# Altium project smart-water-quality-breakout.PrjPcb (part 3 of 5)

## Sheet charger.SchDoc
size A
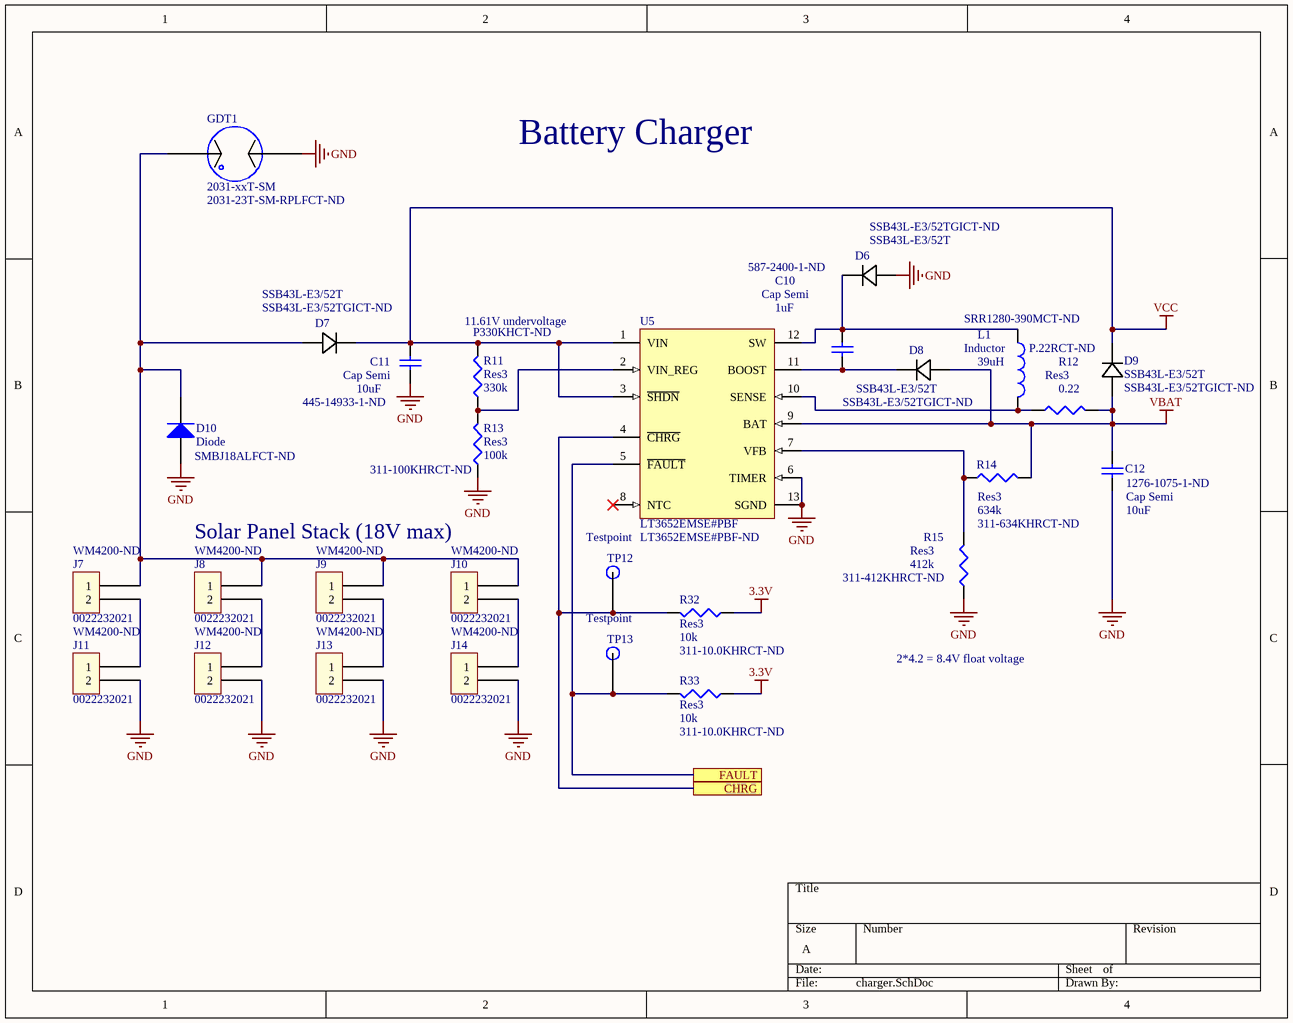
[diagram p2: charger.SchDoc]

### Parts
C10  Cap Semi  value 1uF  Supplier Part Number 1: 587-2400-1-ND  [1608[0603]]
C11  Cap Semi  value 10uF  Supplier Part Number 1: 445-14933-1-ND  [C1210]
C12  Cap Semi  value 10uF  Supplier Part Number 1: 1276-1075-1-ND  [C1206]
D6  SSB43L-E3/52T  Supplier Part Number 1: SSB43L-E3/52TGICT-ND  [DIODE_DO214AA_00]
D7  SSB43L-E3/52T  Supplier Part Number 1: SSB43L-E3/52TGICT-ND  [DIODE_DO214AA_00]
D8  SSB43L-E3/52T  Supplier Part Number 1: SSB43L-E3/52TGICT-ND  [DIODE_DO214AA_00]
D9  SSB43L-E3/52T  Supplier Part Number 1: SSB43L-E3/52TGICT-ND  [DIODE_DO214AA_00]
D10  Diode  Supplier Part Number 1: SMBJ18ALFCT-ND  [smbj]
GDT1  2031-xxT-SM  Supplier Part Number 1: 2031-23T-SM-RPLFCT-ND  [2031-xxT-SM]
J7  0022232021  Supplier Part Number 1: WM4200-ND  [0022232021]
J8  0022232021  Supplier Part Number 1: WM4200-ND  [0022232021]
J9  0022232021  Supplier Part Number 1: WM4200-ND  [0022232021]
J10  0022232021  Supplier Part Number 1: WM4200-ND  [0022232021]
J11  0022232021  Supplier Part Number 1: WM4200-ND  [0022232021]
J12  0022232021  Supplier Part Number 1: WM4200-ND  [0022232021]
J13  0022232021  Supplier Part Number 1: WM4200-ND  [0022232021]
J14  0022232021  Supplier Part Number 1: WM4200-ND  [0022232021]
L1  Inductor  value 39uH  Supplier Part Number 1: SRR1280-390MCT-ND  [SRR1280-390M]
R11  Res3  value 330k  Supplier Part Number 1: P330KHCT-ND  [J1-0603]
R12  Res3  value 0.22  Supplier Part Number 1: P.22RCT-ND  [RESC1206]
R13  Res3  value 100k  Supplier Part Number 1: 311-100KHRCT-ND  [J1-0603]
R14  Res3  value 634k  Supplier Part Number 1: 311-634KHRCT-ND  [J1-0603]
R15  Res3  value 412k  Supplier Part Number 1: 311-412KHRCT-ND  [J1-0603]
R32  Res3  value 10k  Supplier Part Number 1: 311-10.0KHRCT-ND  [J1-0603]
R33  Res3  value 10k  Supplier Part Number 1: 311-10.0KHRCT-ND  [J1-0603]
TP12  Testpoint  [testpoint]  (no BOM)
TP13  Testpoint  [testpoint]  (no BOM)
U5  LT3652EMSE#PBF  Supplier Part Number 1: LT3652EMSE#PBF-ND  [LT-MSE-12-EDP_M]

### Ports
CHRG, FAULT

### Nets
3.3V: R32.1 R33.1
GND: C11.1 C12.1 D6.2 D10.1(A) GDT1.1 J11.2 J12.2 J13.2 J14.2 R13.1 R15.1 U5.6(TIMER) U5.13(SGND)
VBAT: C12.2 D8.2 D9.2 R12.2 R14.2 U5.9(BAT)
VCC: C11.2 D7.1 D9.1 R11.2 U5.1(VIN) U5.3(~{SHDN})
NetC10_1: C10.1 D8.1 U5.11(BOOST)
NetC10_2: C10.2 D6.1 L1.1 U5.12(SW)
NetD7_2: D7.2 D10.2(K) GDT1.2 J7.1 J8.1 J9.1 J10.1
NetJ7_2: J7.2 J11.1
NetJ8_2: J8.2 J12.1
NetJ9_2: J9.2 J13.1
NetJ10_2: J10.2 J14.1
NetL1_2: L1.2 R12.1 U5.10(SENSE)
NetR11_1: R11.1 R13.2 U5.2(VIN_REG)
NetR14_1: R14.1 R15.2 U5.7(VFB)
NetR32_2: R32.2 TP12.1 U5.4(~{CHRG}) ; port CHRG
NetR33_2: R33.2 TP13.1 U5.5(~{FAULT}) ; port FAULT

Not connected (* = marked no-connect by the designer): U5 8(NTC)*

### Notes on the sheet
- Battery Charger
- (near R11) 11.61V undervoltage
- Solar Panel Stack (18V max)
- 2*4.2 = 8.4V float voltage

### Library data of the parts
C10 = Cap Semi: Capacitor (Semiconductor SIM Model); Manufacturer: Taiyo Yuden; Manufacturer Part Number: UMK107BJ105KA-T; Tolerance: 10%; Voltage Rating: 50V; Dielectric: X5R; Published: 8-Jun-2000; LatestRevisionDate: 29-May-2009; LatestRevisionNote: IPC-7351 Footprint Added.; PackageReference: C1206; Publisher: Altium Limited; PackageDescription: Chip Capacitor; Supplier 1: Digi-Key; Stock 1: 3042440; Pricing 1: 1 = 0.21000, 10 = 0.14600, 100 = 0.06880, 500 = 0.04822, 1000 = 0.03993 (USD); RoHS: Yes; Mount: Surface Mount; Case/Package: 0603; Number of Pins: 2; Case Code (Metric): 1608; Case Code (Imperial): 0603; Contact Plating: Nickel; Min Operating Temperature: -55°C; Max Operating Temperature: 85°C; Capacitance: 1uF; Packaging: Tape and Reel; Package Quantity: 1; Voltage Rating (DC): 50V; Termination: SMD/SMT; Length: 1.6mm; Height: 0.8mm; Width: 0.031inch; Thickness: 0.035inch; Depth: 0.8mm; Radiation Hardening: No; REACH SVHC: Unknown; Halogen Free: Halogen Free; ComponentLink1URL: https://datasheet.ciiva.com/5744/1697715-5744913.pdf?src-supplier=Farnell; ComponentLink1Description: https://datasheet.ciiva.com/5744/1697715-5744913.pdf?src-supplier=Farnell; ComponentLink2URL: https://datasheet.ciiva.com/11601/umk107bj105ka-t-ss-11601811.pdf?src-supplier=Avnet; ComponentLink2Description: https://datasheet.ciiva.com/11601/umk107bj105ka-t-ss-11601811.pdf?src-supplier=Avnet; ComponentLink3URL: https://datasheet.ciiva.com/15922/336umk107bj105ka-t-15922611.pdf?src-supplier=Onlinecomponents.com; ComponentLink3Description: https://datasheet.ciiva.com/15922/336umk107bj105ka-t-15922611.pdf?src-supplier=Onlinecomponents.com; ComponentLink4URL: https://datasheet.ciiva.com/134/umk107bj105ka-t-ss-134740.pdf?src-supplier=Digi-Key; ComponentLink4Description: https://datasheet.ciiva.com/134/umk107bj105ka-t-ss-134740.pdf?src-supplier=Digi-Key; ComponentLink5URL: https://datasheet.ciiva.com/30199/43umk107bj105ka-t-30199791.pdf?src-supplier=Onlinecomponents.com; ComponentLink5Description: https://datasheet.ciiva.com/30199/43umk107bj105ka-t-30199791.pdf?src-supplier=Onlinecomponents.com; ComponentLink6URL: https://datasheet.ciiva.com/22694/1697715-22694278.pdf?src-supplier=Element14; ComponentLink6Description: https://datasheet.ciiva.com/22694/1697715-22694278.pdf?src-supplier=Element14; ComponentLink7URL: https://datasheet.ciiva.com/7975/1697715-7975608.pdf?src-supplier=Element14; ComponentLink7Description: https://datasheet.ciiva.com/7975/1697715-7975608.pdf?src-supplier=Element14; ComponentLink8URL: https://datasheet.ciiva.com/7975/mlcc-all-e-7975898.pdf?src-supplier=Element14; ComponentLink8Description: https://datasheet.ciiva.com/7975/mlcc-all-e-7975898.pdf?src-supplier=Element14; ComponentLink9URL: https://datasheet.ciiva.com/5427/mlcc-all-e-541559-5427036.pdf?src-supplier=Mouser; ComponentLink9Description: https://datasheet.ciiva.com/5427/mlcc-all-e-541559-5427036.pdf?src-supplier=Mouser
C11 = Cap Semi: Capacitor (Semiconductor SIM Model); Manufacturer: TDK; Manufacturer Part Number: C3225X7R1H106M250AC; Dielectric Material: Ceramic; Tolerance: 20%; Voltage Rating: 50V; Dielectric: X7R; ComponentLink1URL: https://datasheet.ciiva.com/24216/cga6p3x7s1h106k250ae-266179-24216129.pdf?src-supplier=Mouser; ComponentLink1Description: https://datasheet.ciiva.com/24216/cga6p3x7s1h106k250ae-266179-24216129.pdf?src-supplier=Mouser; ComponentLink2URL: https://datasheet.ciiva.com/46446/1863333-46446041.pdf?src-supplier=Element14; ComponentLink2Description: https://datasheet.ciiva.com/46446/1863333-46446041.pdf?src-supplier=Element14; ComponentLink3URL: https://datasheet.ciiva.com/46446/1863333-46446042.pdf?src-supplier=Element14; ComponentLink3Description: https://datasheet.ciiva.com/46446/1863333-46446042.pdf?src-supplier=Element14; Supplier 1: Digi-Key; Stock 1: 251613; Pricing 1: 1=1.57000, 10=1.24200, 100=0.93150, 500=0.70380 (USD); RoHS: Yes; Mount: Surface Mount; Case/Package: 1210; Weight: 0.000564oz; Case Code (Metric): 3225; Case Code (Imperial): 1210; Min Operating Temperature: -55°C; Max Operating Temperature: 125°C; Package Quantity: 1000; Packaging: Tape and Reel; Capacitance: 10uF; Termination: SMD/SMT; Voltage Rating (DC): 50V; Length: 0.126inch; Height: 2.5mm; Width: 0.098inch; Thickness: 0.11inch; REACH SVHC: No SVHC; Lead Free: Lead Free; ComponentLink4URL: http://www.farnell.com/datasheets/2291921.pdf?src-supplier=Farnell; ComponentLink4Description: http://www.farnell.com/datasheets/2291921.pdf?src-supplier=Farnell; ComponentLink5URL: http://www.mouser.com/ds/2/400/tdk_mlcc_commercial_general_en-542463.pdf?src-supplier=Mouser; ComponentLink5Description: http://www.mouser.com/ds/2/400/tdk_mlcc_commercial_general_en-542463.pdf?src-supplier=Mouser; ComponentLink6URL: https://product.tdk.com/info/en/documents/chara_sheet/C3225X7R1H106M250AC.pdf?src-supplier=Digi-Key; ComponentLink6Description: https://product.tdk.com/info/en/documents/chara_sheet/C3225X7R1H106M250AC.pdf?src-supplier=Digi-Key; ComponentLink7URL: http://product.tdk.com/capacitor/mlcc/en/documents/mlcc_commercial_general_en.pdf?src-supplier=Avnet; ComponentLink7Description: http://product.tdk.com/capacitor/mlcc/en/documents/mlcc_commercial_general_en.pdf?src-supplier=Avnet; ComponentLink8URL: http://www.farnell.com/datasheets/1913358.pdf?src-supplier=Element14; ComponentLink8Description: http://www.farnell.com/datasheets/1913358.pdf?src-supplier=Element14; ComponentLink9URL: http://www.farnell.com/datasheets/2291921.pdf?src-supplier=Newark; ComponentLink9Description: http://www.farnell.com/datasheets/2291921.pdf?src-supplier=Newark
C12 = Cap Semi: Capacitor (Semiconductor SIM Model); Manufacturer: Samsung; Manufacturer Part Number: CL31A106KAHNNNE; Material: Ceramic; Tolerance: 10%; Dielectric: X5R; Voltage: 25V; Published: 8-Jun-2000; LatestRevisionDate: 29-May-2009; LatestRevisionNote: IPC-7351 Footprint Added.; PackageReference: C1206; Publisher: Altium Limited; PackageDescription: Chip Capacitor; Supplier 1: Digi-Key; Stock 1: 1234131; Pricing 1: 1 = 0.22000, 10 = 0.15000, 100 = 0.07600, 500 = 0.05200, 1000 = 0.04600 (USD); RoHS: Yes; Mount: Surface Mount; Case/Package: 1206; Case Code (Metric): 3216; Case Code (Imperial): 1206; Contact Plating: Tin; Min Operating Temperature: -55°C; Max Operating Temperature: 85°C; Capacitance: 10uF; Voltage Rating (DC): 25V; Packaging: Tape and Reel; Voltage Rating: 25V; Length: 3.2mm; Height: 1.6mm; Depth: 1.6mm; Width: 0.063inch; Thickness: 0.071inch; Radiation Hardening: No; Lead Free: Lead Free; ComponentLink1URL: https://datasheet.ciiva.com/25710/cl31a106kahnnne-25710837.pdf?src-supplier=Digi-Key; ComponentLink1Description: https://datasheet.ciiva.com/25710/cl31a106kahnnne-25710837.pdf?src-supplier=Digi-Key; ComponentLink2URL: https://datasheet.ciiva.com/15195/getdatasheetpartid-355210-15195990.pdf?src-supplier=Verical; ComponentLink2Description: https://datasheet.ciiva.com/15195/getdatasheetpartid-355210-15195990.pdf?src-supplier=Verical; ComponentLink3URL: https://datasheet.ciiva.com/29201/452519-da-01-en-vs-kondensator-1206-29201124.pdf?src-supplier=Conrad; ComponentLink3Description: https://datasheet.ciiva.com/29201/452519-da-01-en-vs-kondensator-1206-29201124.pdf?src-supplier=Conrad
D6-D9 = SSB43L-E3/52T: Manufacturer: Vishay Semiconductors; Forward Voltage: 450mV; Peak Reverse Current: 600uA; Forward Current: 4A; Peak Non-Repetitive Surge Current: 100A; Max Repetitive Reverse Voltage (Vrrm): 30V; Element Configuration: Single; Polarity: Standard; Supplier 1: Digi-Key; Manufacturer Part Number: SSB43L-E3/52T; Stock 1: 195068; Pricing 1: 1 = 0.58000, 10 = 0.49300, 100 = 0.36800 (USD); RoHS: Yes; Mount: Surface Mount; Case/Package: SMB; Number of Pins: 2; Contact Plating: Tin; Min Operating Temperature: -65°C; Max Operating Temperature: 150°C; Packaging: Tape and Reel; Package Quantity: 1; Average Rectified Current: 4A; Max Forward Surge Current (Ifsm): 100A; Max Reverse Voltage (DC): 30V; Max Surge Current: 100A; Max Reverse Leakage Current: 600uA; Voltage Rating (DC): 30V; Current Rating: 4A; Output Current: 4A; Length: 4.7mm; Height: 0.095inch; Width: 3.8mm; Radiation Hardening: No; REACH SVHC: Unknown; Lead Free: Lead Free; ComponentLink1URL: https://datasheet.ciiva.com/7962/64541-7962449.pdf?src-supplier=Element14; ComponentLink1Description: https://datasheet.ciiva.com/7962/64541-7962449.pdf?src-supplier=Element14; ComponentLink2URL: https://datasheet.ciiva.com/14634/0900766b80dd0508-14634162.pdf?src-supplier=Allied+Electronics; ComponentLink2Description: https://datasheet.ciiva.com/14634/0900766b80dd0508-14634162.pdf?src-supplier=Allied+Electronics; ComponentLink3URL: https://datasheet.ciiva.com/4245/ssb43l-4245635.pdf?src-supplier=Arrow; ComponentLink3Description: https://datasheet.ciiva.com/4245/ssb43l-4245635.pdf?src-supplier=Arrow; ComponentLink4URL: https://datasheet.ciiva.com/15224/getdatasheetpartid-99263-15224680.pdf?src-supplier=Verical; ComponentLink4Description: https://datasheet.ciiva.com/15224/getdatasheetpartid-99263-15224680.pdf?src-supplier=Verical; ComponentLink5URL: https://datasheet.ciiva.com/18434/70217334-18434422.pdf?src-supplier=Allied+Electronics; ComponentLink5Description: https://datasheet.ciiva.com/18434/70217334-18434422.pdf?src-supplier=Allied+Electronics
D10 = Diode: Default Diode; Manufacturer: Littelfuse; Manufacturer Part Number: SMBJ18A; Clamping Voltage: 29.2V; Peak Pulse Power: 600W; Voltage Rating (DC): 18V; Direction: Unidirectional; Max Surge Current: 20.6A; Min Breakdown Voltage: 20V; Number of Channels: 1; Power Line Protection: No; Max Breakdown Voltage: 22.1V; Test Current: 1mA; Max Reverse Leakage Current: 1uA; Max Power Dissipation: 5W; Element Configuration: Single; ComponentLink1URL: http://www.bourns.com/data/global/pdfs/SMBJ.pdf; ComponentLink1Description: http://www.bourns.com/data/global/pdfs/SMBJ.pdf; Supplier 1: Digi-Key; Stock 1: 15394; Pricing 1: 1 = 0.53000, 10 = 0.41600, 25 = 0.35080, 100 = 0.28550, 250 = 0.23660, 500 = 0.19580, 1000 = 0.14685 (USD); RoHS: Yes; Mount: Surface Mount; Case/Package: SMB; Number of Pins: 2; Min Operating Temperature: -65°C; Max Operating Temperature: 150°C; Packaging: Tape and Reel; Power Dissipation: 600W; Package Quantity: 3000; Operating Supply Voltage: 18V; Reverse Standoff Voltage: 18V; Breakdown Voltage: 20V; Polarity: Unidirectional; Peak Pulse Current: 20.6A; Number of Unidirectional Channels: 1; Termination: SMD/SMT; Composition: Zener; Reverse Breakdown Voltage: 20V; Number of Elements: 1; Leakage Current: 1uA; Length: 4.57mm; Height: 2.237mm; Width: 3.94mm; Radiation Hardening: No; Lead Free: Lead Free; REACH SVHC: Unknown; ComponentLink2URL: https://datasheet.ciiva.com/25624/0900766b810f4eeb-25624683.pdf?src-supplier=RSComponents; ComponentLink2Description: https://datasheet.ciiva.com/25624/0900766b810f4eeb-25624683.pdf?src-supplier=RSComponents; ComponentLink3URL: https://datasheet.ciiva.com/15143/getdatasheetpartid-158332-15143823.pdf?src-supplier=Verical; ComponentLink3Description: https://datasheet.ciiva.com/15143/getdatasheetpartid-158332-15143823.pdf?src-supplier=Verical; ComponentLink4URL: https://datasheet.ciiva.com/331/littelfuse-tvs-diode-smbj-datasheet-pdf-331232.pdf?src-supplier=Digi-Key; ComponentLink4Description: https://datasheet.ciiva.com/331/littelfuse-tvs-diode-smbj-datasheet-pdf-331232.pdf?src-supplier=Digi-Key; ComponentLink5URL: https://datasheet.ciiva.com/8062/littelfuse-tvs-diode-smbj-8062311.pdf?src-supplier=Element14; ComponentLink5Description: https://datasheet.ciiva.com/8062/littelfuse-tvs-diode-smbj-8062311.pdf?src-supplier=Element14; ComponentLink6URL: https://datasheet.ciiva.com/331/littelfuse-tvs-diode-smbj-datasheet-pdf-331230.pdf?src-supplier=Digi-Key; ComponentLink6Description: https://datasheet.ciiva.com/331/littelfuse-tvs-diode-smbj-datasheet-pdf-331230.pdf?src-supplier=Digi-Key; ComponentLink7URL: https://datasheet.ciiva.com/331/littelfuse-tvs-diode-smbj-datasheet-pdf-331231.pdf?src-supplier=Digi-Key; ComponentLink7Description: https://datasheet.ciiva.com/331/littelfuse-tvs-diode-smbj-datasheet-pdf-331231.pdf?src-supplier=Digi-Key; ComponentLink8URL: https://datasheet.ciiva.com/16354/littelfuse-tvs-diode-smbj-16354943.pdf?src-supplier=Future+Electronics; ComponentLink8Description: https://datasheet.ciiva.com/16354/littelfuse-tvs-diode-smbj-16354943.pdf?src-supplier=Future+Electronics
GDT1 = 2031-xxT-SM: Gas discharge tube; Manufacturer: Bourns Inc.; Manufacturer Part Number: 2031-23T-SM-RPLF; Voltage - DC Spark Over (Nom): 185V; Impulse Discharge Current (8/20µs): 150A (10/700µs); Number of Poles: 2; Fail Short: No; Supplier 1: Digi-Key; RoHS: RoHS Compliant; Category: Circuit Protection; Stock 1: 847; Pricing 1: 1=1.44, 10=1.307, 25=1.2644, 50=1.0836, 100=0.903, 250=0.8772, 500=0.7439 (USD); Packaging: Cut Tape (CT); Tolerance: -; Mounting Type: Surface Mount; Package / Case: 2-SMD Cylinder Square End; Current - AC Discharge (Nom): -; ComponentLink1URL: http://www.bourns.com/data/global/pdfs/2031-xxT.pdf; ComponentLink1Description: http://www.bourns.com/data/global/pdfs/2031-xxT.pdf
J7-J14 = 0022232021: Manufacturer: Molex; Number of Contacts: 2; Gender: Male; Contact Resistance: 10mR; Max Current Rating: 4A; Voltage Rating: 250V; Insulation Resistance: 500GR; Pitch: 2.54mm; Approvals: UL; Glow Wire Compliant: Non-compliant; Supplier 1: Digi-Key; Manufacturer Part Number: 22-23-2021; Stock 1: 76471; Pricing 1: 1=0.17000, 10=0.16100, 100=0.11150, 500=0.09438, 1000=0.07722, 5000=0.06864, 10000=0.06221 (USD); RoHS: Yes; Mount: Through Hole; Contact Plating: Tin; Contact Material: Brass; Color: White; Housing Color: White; Housing Material: Nylon; Min Operating Temperature: 0°C; Max Operating Temperature: 75°C; Termination: Through Hole; Number of Rows: 1; Package Quantity: 3000; Packaging: Bulk; Number of Positions: 2; Orientation: Straight; Number of Circuits: 2; Current Rating: 4A; Voltage Rating (DC): 250V; Length: 5.08mm; Height: 10.67mm; Depth: 6.35mm; Radiation Hardening: No; REACH SVHC: Unknown; Halogen Free: Low Halogen; Lead Free: Lead Free; Flammability Rating: UL94 V-0; ComponentLink1URL: https://datasheet.ciiva.com/19454/232266-19454304.pdf?src-supplier=Jameco; ComponentLink1Description: https://datasheet.ciiva.com/19454/232266-19454304.pdf?src-supplier=Jameco; ComponentLink2URL: https://datasheet.ciiva.com/22683/1834442-22683561.pdf?src-supplier=Element14; ComponentLink2Description: https://datasheet.ciiva.com/22683/1834442-22683561.pdf?src-supplier=Element14; ComponentLink3URL: https://datasheet.ciiva.com/5150/0022232021-pcb-headers-227096-5150681.pdf?src-supplier=Mouser; ComponentLink3Description: https://datasheet.ciiva.com/5150/0022232021-pcb-headers-227096-5150681.pdf?src-supplier=Mouser; ComponentLink4URL: https://datasheet.ciiva.com/11746/0900766b80d8f4d1-11746058.pdf?src-supplier=RSComponents; ComponentLink4Description: https://datasheet.ciiva.com/11746/0900766b80d8f4d1-11746058.pdf?src-supplier=RSComponents; ComponentLink5URL: https://datasheet.ciiva.com/30253/114200022232021-pcb-headers-30253002.pdf?src-supplier=Onlinecomponents.com; ComponentLink5Description: https://datasheet.ciiva.com/30253/114200022232021-pcb-headers-30253002.pdf?src-supplier=Onlinecomponents.com; ComponentLink6URL: https://datasheet.ciiva.com/16658/0022232021-pcb-headers-16658167.pdf?src-supplier=Avnet+Europe; ComponentLink6Description: https://datasheet.ciiva.com/16658/0022232021-pcb-headers-16658167.pdf?src-supplier=Avnet+Europe; ComponentLink7URL: https://datasheet.ciiva.com/18453/70190606-18453638.pdf?src-supplier=Allied+Electronics; ComponentLink7Description: https://datasheet.ciiva.com/18453/70190606-18453638.pdf?src-supplier=Allied+Electronics; ComponentLink8URL: https://datasheet.ciiva.com/9468/0022232021-pcb-headers-9468476.pdf?src-supplier=Avnet; ComponentLink8Description: https://datasheet.ciiva.com/9468/0022232021-pcb-headers-9468476.pdf?src-supplier=Avnet
L1 = Inductor: Manufacturer: Bourns; Code_IEC: 1005; Core Material: Ferrite; Material: Steel; Inductance Tolerance: 20%; Q Factor: 24; Self Resonant Frequency: 8.5MHz; Current Rating: 3.2A; Saturation Current: 3.1A; Shielding: Shielded; Resistance: 70MR; Test Frequency: 2.52MHz; Published: 8-Jun-2000; LatestRevisionDate: 29-May-2009; LatestRevisionNote: IPC-7351 Footprint Added.; PackageReference: 0402-A; Publisher: Altium Limited; PackageDescription: Chip Inductor; Code_JEITA: 0402; Supplier 1: Digi-Key; Manufacturer Part Number: SRR1280-390M; Stock 1: 6267; Pricing 1: 1 = 1.25000, 10 = 1.15900, 100 = 0.83780 (USD); RoHS: Yes; Mount: Surface Mount; Case/Package: Nonstandard; Number of Pins: 2; Min Operating Temperature: -40°C; Max Operating Temperature: 125°C; Packaging: Tape and Reel; Tolerance: 20%; Package Quantity: 400; Frequency: 8.5MHz; Inductance: 39uH; Max DC Current: 3.2A; DC Resistance (DCR): 70mR; Termination: SMD/SMT; Composition: Wirewound; DC Current: 3.2A; Military Standard: Not; RMS Current (Irms): 3.2A; Length: 12.5mm; Height: 7.5mm; Width: 12.5mm; Height - Seated (Max): 0.315inch; Depth: 12.8mm; REACH SVHC: No SVHC; ComponentLink1URL: https://datasheet.ciiva.com/1062/srr1280-1062601.pdf?src-supplier=Digi-Key; ComponentLink1Description: https://datasheet.ciiva.com/1062/srr1280-1062601.pdf?src-supplier=Digi-Key; ComponentLink2URL: https://datasheet.ciiva.com/1062/srr1280-1062602.pdf?src-supplier=Digi-Key; ComponentLink2Description: https://datasheet.ciiva.com/1062/srr1280-1062602.pdf?src-supplier=Digi-Key; ComponentLink3URL: https://datasheet.ciiva.com/48684/srr1280-48684942.pdf?src-supplier=Avnet; ComponentLink3Description: https://datasheet.ciiva.com/48684/srr1280-48684942.pdf?src-supplier=Avnet
R11 = Res3: Resistor; Manufacturer: Panasonic; Manufacturer Part Number: ERJ-3EKF3303V; Tolerance: 1%; Power Rating: 100mW; Voltage Rating: 75V; Resistance: 330kR; Temperature Coefficient: 100ppm/°C; Published: 8-Jun-2000; LatestRevisionDate: 29-May-2009; LatestRevisionNote: IPC-7351 Footprint Added.; PackageReference: J1-0603; Publisher: Altium Limited; PackageDescription: Chip Resistor; Supplier 1: Digi-Key; Stock 1: 836713; Pricing 1: 1=0.10000, 10=0.06500, 100=0.02640, 1000=0.01186, 2500=0.01029 (USD); RoHS: Yes; Mount: Surface Mount; Case/Package: 0603; Number of Pins: 2; Weight: 7.1E-05oz; Case Code (Imperial): 0603; Case Code (Metric): 1608; Contact Plating: Tin; Min Operating Temperature: -55°C; Max Operating Temperature: 155°C; Packaging: Tape and Reel; Package Quantity: 1; Composition: Thick Film; Termination: SMD/SMT; Number of Terminations: 2; Military Standard: Not; Max Power Dissipation: 100mW; Voltage Rating (DC): 75V; Features: Automotive AEC-Q200; Length: 1.6mm; Height: 0.022inch; Width: 0.8mm; Depth: 0.8mm; Radiation Hardening: No; REACH SVHC: No SVHC; Lead Free: Lead Free; ComponentLink1URL: https://datasheet.ciiva.com/17206/aoa0000ce2-17206262.pdf?src-supplier=Avnet+Europe; ComponentLink1Description: https://datasheet.ciiva.com/17206/aoa0000ce2-17206262.pdf?src-supplier=Avnet+Europe; ComponentLink2URL: https://datasheet.ciiva.com/22673/1678782-22673287.pdf?src-supplier=Element14; ComponentLink2Description: https://datasheet.ciiva.com/22673/1678782-22673287.pdf?src-supplier=Element14; ComponentLink3URL: https://datasheet.ciiva.com/16766/70260748-16766613.pdf?src-supplier=Allied+Electronics; ComponentLink3Description: https://datasheet.ciiva.com/16766/70260748-16766613.pdf?src-supplier=Allied+Electronics; ComponentLink4URL: https://datasheet.ciiva.com/7836/aoa0000ce2-7836502.pdf?src-supplier=Element14; ComponentLink4Description: https://datasheet.ciiva.com/7836/aoa0000ce2-7836502.pdf?src-supplier=Element14; ComponentLink5URL: https://datasheet.ciiva.com/24164/aoa0000ce2-24164038.pdf?src-supplier=Mouser; ComponentLink5Description: https://datasheet.ciiva.com/24164/aoa0000ce2-24164038.pdf?src-supplier=Mouser; ComponentLink6URL: https://datasheet.ciiva.com/9117/aoa0000ce2-9117145.pdf?src-supplier=Avnet; ComponentLink6Description: https://datasheet.ciiva.com/9117/aoa0000ce2-9117145.pdf?src-supplier=Avnet; ComponentLink7URL: https://datasheet.ciiva.com/16781/70260748-16781705.pdf?src-supplier=Allied+Electronics; ComponentLink7Description: https://datasheet.ciiva.com/16781/70260748-16781705.pdf?src-supplier=Allied+Electronics; ComponentLink8URL: https://datasheet.ciiva.com/9182/aoa0000ce2-9182954.pdf?src-supplier=Avnet; ComponentLink8Description: https://datasheet.ciiva.com/9182/aoa0000ce2-9182954.pdf?src-supplier=Avnet; ComponentLink9URL: https://datasheet.ciiva.com/30247/aoa0000ce2-30247322.pdf?src-supplier=Onlinecomponents.com; ComponentLink9Description: https://datasheet.ciiva.com/30247/aoa0000ce2-30247322.pdf?src-supplier=Onlinecomponents.com; ComponentLink10URL: https://datasheet.ciiva.com/22687/1678782-22687435.pdf?src-supplier=Element14; ComponentLink10Description: https://datasheet.ciiva.com/22687/1678782-22687435.pdf?src-supplier=Element14
R12 = Res3: Resistor; Manufacturer: Panasonic; Manufacturer Part Number: ERJ-8RQFR22V; Resistance: 220mR; Tolerance: 1%; Temperature Coefficient: 250ppm/°C; Power Rating: 250mW; Published: 8-Jun-2000; LatestRevisionDate: 29-May-2009; LatestRevisionNote: IPC-7351 Footprint Added.; PackageReference: J1-0603; Publisher: Altium Limited; PackageDescription: Chip Resistor; Supplier 1: Digi-Key; Stock 1: 127343; Pricing 1: 1 = 0.39000, 10 = 0.28300, 25 = 0.20920, 50 = 0.15420, 100 = 0.11320, 250 = 0.09348, 500 = 0.07708, 1000 = 0.05576 (USD); RoHS: Yes; Mount: Surface Mount; Case/Package: 1206; Number of Pins: 2; Contact Plating: Tin; Case Code (Imperial): 1206; Case Code (Metric): 3216; Min Operating Temperature: -55°C; Max Operating Temperature: 125°C; Composition: Thick Film; Packaging: Tape and Reel; Package Quantity: 1; Termination: SMD/SMT; Number of Terminations: 2; Military Standard: Not; Max Power Dissipation: 250mW; Features: Automotive AEC-Q200; Length: 3.2mm; Height: 0.6mm; Width: 1.6mm; Depth: 1.6mm; Radiation Hardening: No; REACH SVHC: Unknown; Lead Free: Lead Free; ComponentLink1URL: https://datasheet.ciiva.com/11818/0900766b80eefa12-11818582.pdf?src-supplier=RSComponents; ComponentLink1Description: https://datasheet.ciiva.com/11818/0900766b80eefa12-11818582.pdf?src-supplier=RSComponents; ComponentLink2URL: https://datasheet.ciiva.com/28548/1790602-28548389.pdf?src-supplier=Element14; ComponentLink2Description: https://datasheet.ciiva.com/28548/1790602-28548389.pdf?src-supplier=Element14; ComponentLink3URL: https://datasheet.ciiva.com/16773/70068852-16773943.pdf?src-supplier=Allied+Electronics; ComponentLink3Description: https://datasheet.ciiva.com/16773/70068852-16773943.pdf?src-supplier=Allied+Electronics; ComponentLink4URL: https://datasheet.ciiva.com/28694/1790602-28694263.pdf?src-supplier=Element14; ComponentLink4Description: https://datasheet.ciiva.com/28694/1790602-28694263.pdf?src-supplier=Element14; ComponentLink5URL: https://datasheet.ciiva.com/24073/aoa0000ce3-72189-24073048.pdf?src-supplier=Mouser; ComponentLink5Description: https://datasheet.ciiva.com/24073/aoa0000ce3-72189-24073048.pdf?src-supplier=Mouser; ComponentLink6URL: https://datasheet.ciiva.com/9184/aoa0000ce3-9184313.pdf?src-supplier=Avnet; ComponentLink6Description: https://datasheet.ciiva.com/9184/aoa0000ce3-9184313.pdf?src-supplier=Avnet; ComponentLink7URL: https://datasheet.ciiva.com/16395/aoa0000ce3-16395226.pdf?src-supplier=Future+Electronics; ComponentLink7Description: https://datasheet.ciiva.com/16395/aoa0000ce3-16395226.pdf?src-supplier=Future+Electronics; ComponentLink8URL: https://datasheet.ciiva.com/17206/aoa0000ce3-17206890.pdf?src-supplier=Avnet+Europe; ComponentLink8Description: https://datasheet.ciiva.com/17206/aoa0000ce3-17206890.pdf?src-supplier=Avnet+Europe; ComponentLink9URL: https://datasheet.ciiva.com/6064/391509-6064715.pdf?src-supplier=Farnell; ComponentLink9Description: https://datasheet.ciiva.com/6064/391509-6064715.pdf?src-supplier=Farnell; ComponentLink10URL: https://datasheet.ciiva.com/16778/70068852-16778907.pdf?src-supplier=Allied+Electronics; ComponentLink10Description: https://datasheet.ciiva.com/16778/70068852-16778907.pdf?src-supplier=Allied+Electronics; ComponentLink11URL: https://datasheet.ciiva.com/30088/6aoa0000ce3-30088699.pdf?src-supplier=Onlinecomponents.com; ComponentLink11Description: https://datasheet.ciiva.com/30088/6aoa0000ce3-30088699.pdf?src-supplier=Onlinecomponents.com; ComponentLink12URL: https://datasheet.ciiva.com/7710/391509-7710844.pdf?src-supplier=Element14; ComponentLink12Description: https://datasheet.ciiva.com/7710/391509-7710844.pdf?src-supplier=Element14; ComponentLink13URL: https://datasheet.ciiva.com/6064/391509-6064717.pdf?src-supplier=Farnell; ComponentLink13Description: https://datasheet.ciiva.com/6064/391509-6064717.pdf?src-supplier=Farnell; ComponentLink14URL: https://datasheet.ciiva.com/31406/1790602-31406415.pdf?src-supplier=Farnell; ComponentLink14Description: https://datasheet.ciiva.com/31406/1790602-31406415.pdf?src-supplier=Farnell
R13 = Res3: Resistor; Manufacturer: Yageo; Manufacturer Part Number: RC0603FR-07100KL; Tolerance: 1%; Resistance: 100kR; Temperature Coefficient: 100ppm/°C; Voltage Rating (DC): 50V; Power Rating: 100mW; Working Voltage: 75V; Published: 8-Jun-2000; LatestRevisionDate: 29-May-2009; LatestRevisionNote: IPC-7351 Footprint Added.; PackageReference: J1-0603; Publisher: Altium Limited; PackageDescription: Chip Resistor; Supplier 1: Digi-Key; Stock 1: 48923364; Pricing 1: 1=0.10000, 10=0.02400, 100=0.00970, 1000=0.00437, 2500=0.00379 (USD); RoHS: Yes; Case/Package: 0603; Number of Pins: 2; Case Code (Imperial): 0603; Case Code (Metric): 1608; Min Operating Temperature: -55°C; Max Operating Temperature: 155°C; Packaging: Tape and Reel; Composition: Thick Film; Military Standard: Not; Voltage Rating: 50V; Termination: SMD/SMT; Number of Terminations: 2; Length: 1.6mm; Height: 0.45mm; Width: 0.8mm; Depth: 0.8mm; REACH SVHC: No SVHC; Lead Free: Lead Free; ComponentLink1URL: https://datasheet.ciiva.com/11808/0900766b80f96399-11808107.pdf?src-supplier=RSComponents; ComponentLink1Description: https://datasheet.ciiva.com/11808/0900766b80f96399-11808107.pdf?src-supplier=RSComponents; ComponentLink2URL: https://datasheet.ciiva.com/7983/443971-7983593.pdf?src-supplier=Element14; ComponentLink2Description: https://datasheet.ciiva.com/7983/443971-7983593.pdf?src-supplier=Element14; ComponentLink3URL: https://datasheet.ciiva.com/46440/1868787-46440889.pdf?src-supplier=Element14; ComponentLink3Description: https://datasheet.ciiva.com/46440/1868787-46440889.pdf?src-supplier=Element14; ComponentLink4URL: https://datasheet.ciiva.com/7746/1738695-7746234.pdf?src-supplier=Element14; ComponentLink4Description: https://datasheet.ciiva.com/7746/1738695-7746234.pdf?src-supplier=Element14; ComponentLink5URL: https://datasheet.ciiva.com/7746/1738695-7746235.pdf?src-supplier=Element14; ComponentLink5Description: https://datasheet.ciiva.com/7746/1738695-7746235.pdf?src-supplier=Element14; ComponentLink6URL: https://datasheet.ciiva.com/22747/443971-22747516.pdf?src-supplier=Element14; ComponentLink6Description: https://datasheet.ciiva.com/22747/443971-22747516.pdf?src-supplier=Element14
R14 = Res3: Resistor; Manufacturer: Yageo; Manufacturer Part Number: RC0603FR-07634KL; Tolerance: 1%; Resistance: 634kR; Power Rating: 100mW; Voltage Rating: 50V; Temperature Coefficient: 100ppm/°C; Published: 8-Jun-2000; LatestRevisionDate: 29-May-2009; LatestRevisionNote: IPC-7351 Footprint Added.; PackageReference: J1-0603; Publisher: Altium Limited; PackageDescription: Chip Resistor; Supplier 1: Digi-Key; Stock 1: 347605; Pricing 1: 1 = 0.10000, 10 = 0.02400, 100 = 0.00970, 1000 = 0.00437, 2500 = 0.00379 (USD); RoHS: Yes; Case/Package: 0603; Case Code (Metric): 1608; Case Code (Imperial): 0603; Min Operating Temperature: -55°C; Max Operating Temperature: 155°C; Package Quantity: 1; Packaging: Tape and Reel; Composition: Thick Film; Number of Terminations: 2; Termination: SMD/SMT; Military Standard: Not; Max Power Dissipation: 100mW; Voltage Rating (DC): 50V; Features: Moisture Resistant; Length: 1.6mm; Height: 0.022inch; Width: 0.031inch; Depth: 0.8mm; Lead Free: Lead Free; ComponentLink1URL: https://datasheet.ciiva.com/2455/pyu-r-int-thick-7-2455320.pdf?src-supplier=Digi-Key; ComponentLink1Description: https://datasheet.ciiva.com/2455/pyu-r-int-thick-7-2455320.pdf?src-supplier=Digi-Key; ComponentLink2URL: https://datasheet.ciiva.com/2455/pyu-r-int-thick-7-2455321.pdf?src-supplier=Digi-Key; ComponentLink2Description: https://datasheet.ciiva.com/2455/pyu-r-int-thick-7-2455321.pdf?src-supplier=Digi-Key; ComponentLink3URL: https://datasheet.ciiva.com/2455/pyu-r-int-thick-7-2455322.pdf?src-supplier=Digi-Key; ComponentLink3Description: https://datasheet.ciiva.com/2455/pyu-r-int-thick-7-2455322.pdf?src-supplier=Digi-Key; ComponentLink4URL: https://datasheet.ciiva.com/12560/rc0603-272842-12560941.pdf?src-supplier=Mouser; ComponentLink4Description: https://datasheet.ciiva.com/12560/rc0603-272842-12560941.pdf?src-supplier=Mouser
R15 = Res3: Resistor; Manufacturer: Yageo; Manufacturer Part Number: RC0603FR-07412KL; Resistance: 412kR; Tolerance: 1%; Voltage Rating (DC): 50V; Max Power Dissipation: 100mW; Temperature Coefficient: 100ppm/°C; Published: 8-Jun-2000; LatestRevisionDate: 29-May-2009; LatestRevisionNote: IPC-7351 Footprint Added.; PackageReference: J1-0603; Publisher: Altium Limited; PackageDescription: Chip Resistor; Supplier 1: Digi-Key; Stock 1: 153403; Pricing 1: 1 = 0.10000, 10 = 0.02400, 100 = 0.00970, 1000 = 0.00437, 2500 = 0.00379 (USD); RoHS: Yes; Case/Package: 0603; Case Code (Metric): 1608; Case Code (Imperial): 0603; Min Operating Temperature: -55°C; Max Operating Temperature: 155°C; Packaging: Tape and Reel; Package Quantity: 1; Composition: Thick Film; Number of Terminations: 2; Features: Moisture Resistant; Military Standard: Not; Length: 0.063inch; Height: 0.022inch; Width: 0.031inch; Depth: 0.8mm; Lead Free: Lead Free; ComponentLink1URL: https://datasheet.ciiva.com/2454/pyu-r-int-thick-7-2454489.pdf?src-supplier=Digi-Key; ComponentLink1Description: https://datasheet.ciiva.com/2454/pyu-r-int-thick-7-2454489.pdf?src-supplier=Digi-Key; ComponentLink2URL: https://datasheet.ciiva.com/2454/pyu-r-int-thick-7-2454490.pdf?src-supplier=Digi-Key; ComponentLink2Description: https://datasheet.ciiva.com/2454/pyu-r-int-thick-7-2454490.pdf?src-supplier=Digi-Key; ComponentLink3URL: https://datasheet.ciiva.com/2454/pyu-r-int-thick-7-2454491.pdf?src-supplier=Digi-Key; ComponentLink3Description: https://datasheet.ciiva.com/2454/pyu-r-int-thick-7-2454491.pdf?src-supplier=Digi-Key
R32 R33 = Res3: Resistor; Manufacturer: Yageo; Manufacturer Part Number: RC0603FR-0710KL; Tolerance: 1%; Resistance: 10kR; Temperature Coefficient: 100ppm/°C; Voltage Rating (DC): 50V; Power Rating: 100mW; Voltage Rating: 75V; Published: 8-Jun-2000; LatestRevisionDate: 29-May-2009; LatestRevisionNote: IPC-7351 Footprint Added.; PackageReference: J1-0603; Publisher: Altium Limited; PackageDescription: Chip Resistor; Supplier 1: Digi-Key; Stock 1: 90146690; Pricing 1: 1 = 0.10000, 10 = 0.02400, 100 = 0.00970, 1000 = 0.00437, 2500 = 0.00379 (USD); RoHS: Yes; Case/Package: 0603; Number of Pins: 2; Weight: 7.1E-05oz; Case Code (Imperial): 0603; Case Code (Metric): 1608; Min Operating Temperature: -55°C; Max Operating Temperature: 155°C; Composition: Thick Film; Packaging: Tape and Reel; Military Standard: Not; Termination: SMD/SMT; Length: 1.6mm; Height: 0.45mm; Width: 0.8mm; Depth: 0.8mm; Lead Pitch: 0.3mm; REACH SVHC: No SVHC; Lead Free: Lead Free; ComponentLink1URL: https://datasheet.ciiva.com/7660/38590-7660789.pdf?src-supplier=Element14; ComponentLink1Description: https://datasheet.ciiva.com/7660/38590-7660789.pdf?src-supplier=Element14; ComponentLink2URL: https://datasheet.ciiva.com/15189/getdatasheetpartid-409289-15189591.pdf?src-supplier=Verical; ComponentLink2Description: https://datasheet.ciiva.com/15189/getdatasheetpartid-409289-15189591.pdf?src-supplier=Verical; ComponentLink3URL: https://datasheet.ciiva.com/46440/1868787-46440891.pdf?src-supplier=Element14; ComponentLink3Description: https://datasheet.ciiva.com/46440/1868787-46440891.pdf?src-supplier=Element14; ComponentLink4URL: https://datasheet.ciiva.com/7983/443971-7983596.pdf?src-supplier=Element14; ComponentLink4Description: https://datasheet.ciiva.com/7983/443971-7983596.pdf?src-supplier=Element14; ComponentLink5URL: https://datasheet.ciiva.com/7746/1738695-7746239.pdf?src-supplier=Element14; ComponentLink5Description: https://datasheet.ciiva.com/7746/1738695-7746239.pdf?src-supplier=Element14; ComponentLink6URL: https://datasheet.ciiva.com/22747/443971-22747519.pdf?src-supplier=Element14; ComponentLink6Description: https://datasheet.ciiva.com/22747/443971-22747519.pdf?src-supplier=Element14
TP12 TP13 = SMT Testpoint
U5 = CMP-0473-00138-1: Power Tracking 2 A Battery Charger for Solar Power, 12-pin SOP (MSE-12-EDP), -40 to 125 degC, Pb-Free; Manufacturer: Linear Technology; Vin Max(V): 32; Number of Outputs: 1; Vin Min(V): 4.95; Number of Cells: 3; Output Voltage: 4.2V; Min Supply Voltage: 4.95V; Max Supply Voltage: 32V; Max Output Current: 2A; Max Output Voltage: 14.4V; Topology: Battery Charger; ComponentLink1Description: Manufacturer URL; PartNumber: LT3652EMSE#PBF; ComponentLink2URL: http://cds.linear.com/docs/en/datasheet/3652fd.pdf; ComponentLink1URL: http://www.linear.com/; ComponentLink2Description: Datasheet; Mounting Technology: Surface Mount; Energy Source: Solar; DatasheetVersion: Rev. D; RoHS: TRUE; PackageDescription: 12-Pin Plastic MSOP, Exposed Die Pad, Body 4.039 x 3 mm, Pitch 0.65 mm; ComponentLink3URL: http://cds.linear.com/docs/en/packaging/05081666_G_MSE12.pdf; ComponentLink3Description: Package Specification; PackageVersion: Rev. G, 05/2013; PackageReference: MSE-12-EDP; Supplier 1: Digi-Key; Manufacturer Part Number: LT3652EMSE#PBF; Stock 1: 9413; Pricing 1: 1 = 7.40000, 25 = 4.91040, 100 = 4.06000, 250 = 3.85700, 500 = 3.77000 (USD); Case/Package: MSOP; Number of Pins: 12; Min Operating Temperature: -40°C; Max Operating Temperature: 125°C; Package Quantity: 37; Packaging: Rail/Tube; Max Input Voltage: 32V; Min Input Voltage: 4.95V; Max Charge Current: 2A; Length: 4.04mm; Height: 0.86mm; Width: 3mm; Radiation Hardening: No; REACH SVHC: No SVHC; ComponentLink4URL: https://datasheet.ciiva.com/15114/getdatasheetpartid-367678-15114671.pdf?src-supplier=Verical; ComponentLink4Description: https://datasheet.ciiva.com/15114/getdatasheetpartid-367678-15114671.pdf?src-supplier=Verical; ComponentLink5URL: https://datasheet.ciiva.com/1932/28522-1932092.pdf?src-supplier=Digi-Key; ComponentLink5Description: https://datasheet.ciiva.com/1932/28522-1932092.pdf?src-supplier=Digi-Key; ComponentLink6URL: https://datasheet.ciiva.com/1139/1692510-1139705.pdf?src-supplier=Farnell; ComponentLink6Description: https://datasheet.ciiva.com/1139/1692510-1139705.pdf?src-supplier=Farnell